# EAGLE design routev3.2 (EAGLE 8.6.0)

## Sheet 1 of 2
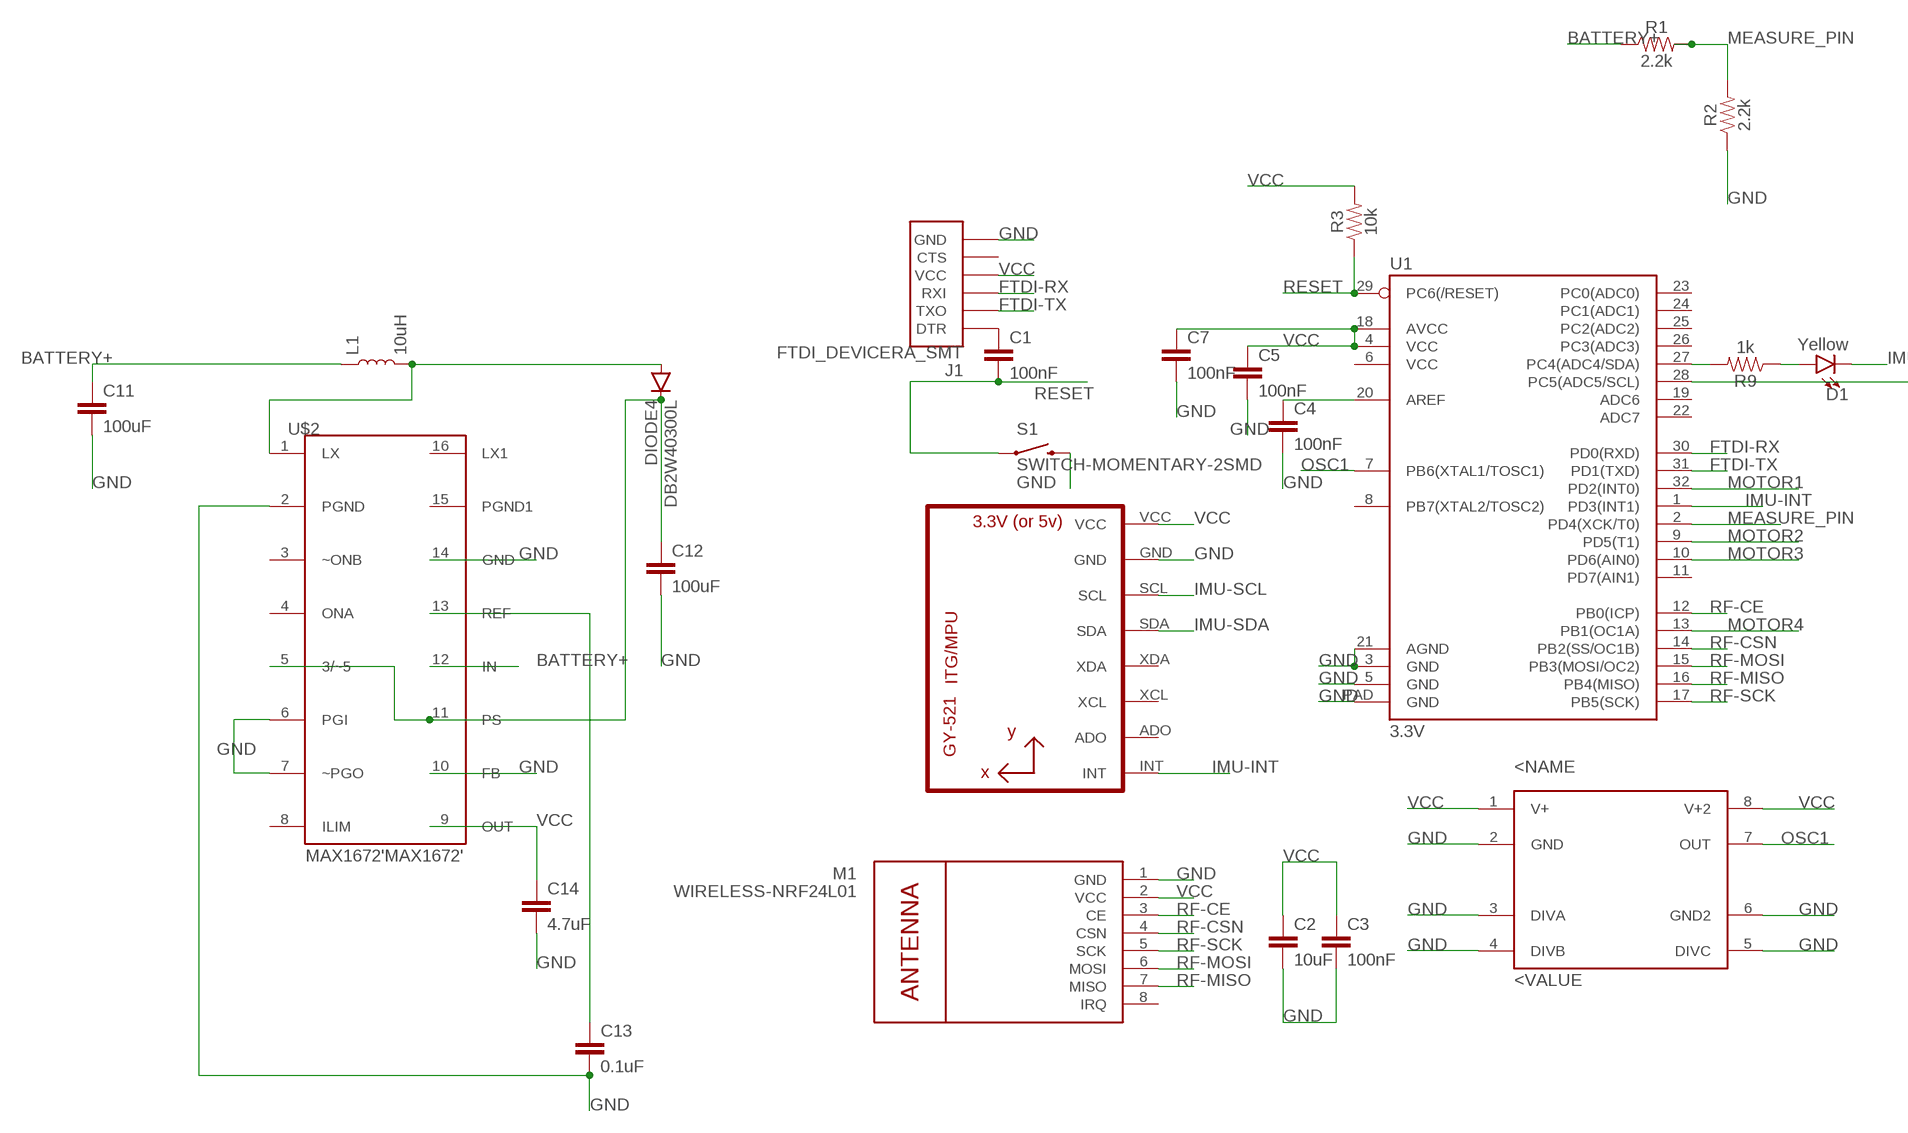
[diagram p0: schematic, sheet 1, part 1 of 2]
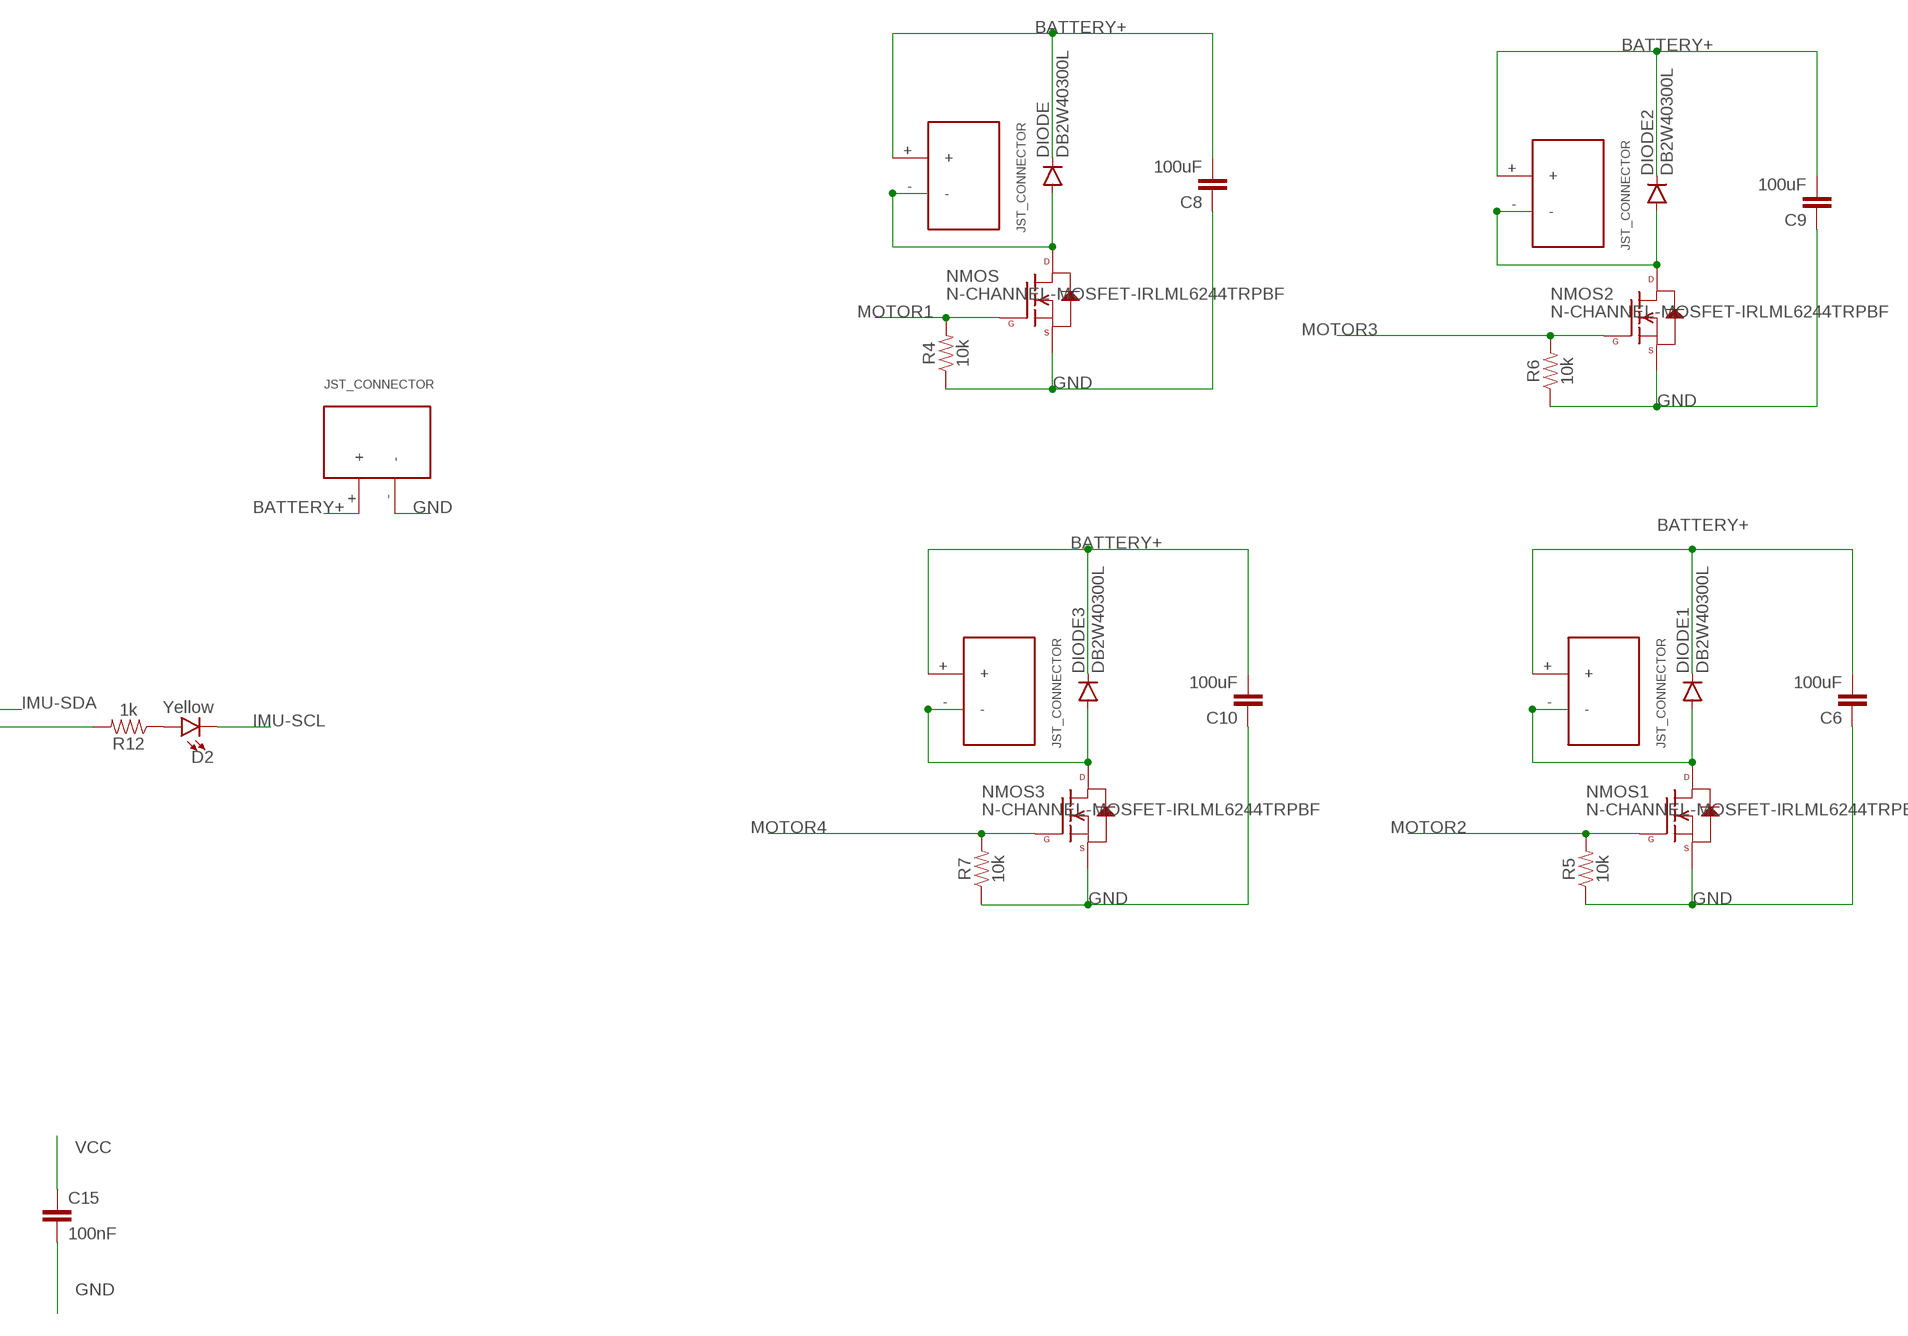
[diagram p1: schematic, sheet 1, part 2 of 2]

### Parts
C1  100nF  0.1UF-25V(+80/-20%)(0603)  [0603-CAP]
C2  10uF  CAP0603-CAP  [0603-CAP]
C3  100nF  CAP0603-CAP  [0603-CAP]
C4  100nF  CAP0603-CAP  [0603-CAP]
C5  100nF  CAP0603-CAP  [0603-CAP]
C6  100uF  CAP0603-CAP  [0603-CAP]
C7  100nF  CAP0603-CAP  [0603-CAP]
C8  100uF  CAP0603-CAP  [0603-CAP]
C9  100uF  CAP0603-CAP  [0603-CAP]
C10  100uF  CAP0603-CAP  [0603-CAP]
C11  100uF  CAP0603-CAP  [0603-CAP]
C12  100uF  CAP0603-CAP  [0603-CAP]
C13  0.1uF  CAP0603-CAP  [0603-CAP]
C14  4.7uF  CAP0603-CAP  [0603-CAP]
C15  100nF  0.1UF-25V(+80/-20%)(0603)  [0603-CAP]
D1  Yellow  LED-YELLOWLILYPAD  [LED-1206]
D2  Yellow  LED-YELLOWLILYPAD  [LED-1206]
DIODE  DB2W40300L  [MINI2-F3-B]
DIODE1  DB2W40300L  [MINI2-F3-B]
DIODE2  DB2W40300L  [MINI2-F3-B]
DIODE3  DB2W40300L  [MINI2-F3-B]
DIODE4  DB2W40300L  [MINI2-F3-B]
J1  FTDI_DEVICERA_SMT  [FTDI_DEVICE_RA_SMT]
L1  10uH  INDUCTOR-0603-33NH  [0603]
M1  WIRELESS-NRF24L01  [WIRELESS-NRF24L01]
MOTOR  JST_CONNECTOR_FEMALE  [JST_CONNECTOR_FEMALE]
MOTOR1  JST_CONNECTOR_FEMALE  [JST_CONNECTOR_FEMALE]
MOTOR2  JST_CONNECTOR_FEMALE  [JST_CONNECTOR_FEMALE]
MOTOR3  JST_CONNECTOR_FEMALE  [JST_CONNECTOR_FEMALE]
NMOS  N-CHANNEL-MOSFET-IRLML6244TRPBF  [SOT23-3]
NMOS1  N-CHANNEL-MOSFET-IRLML6244TRPBF  [SOT23-3]
NMOS2  N-CHANNEL-MOSFET-IRLML6244TRPBF  [SOT23-3]
NMOS3  N-CHANNEL-MOSFET-IRLML6244TRPBF  [SOT23-3]
R1  2.2k  2.2KOHM-0603-1/10W-1%  [0603]
R2  2.2k  2.2KOHM-0603-1/10W-1%  [0603]
R3  10k  2.2KOHM-0603-1/10W-1%  [0603]
R4  10k  2.2KOHM-0603-1/10W-1%  [0603]
R5  10k  2.2KOHM-0603-1/10W-1%  [0603]
R6  10k  2.2KOHM-0603-1/10W-1%  [0603]
R7  10k  2.2KOHM-0603-1/10W-1%  [0603]
R9  1k  2.2KOHM-0603-1/10W-1%  [0603]
R12  1k  2.2KOHM-0603-1/10W-1%  [0603]
S1  SWITCH-MOMENTARY-2SMD  [TACTILE-SWITCH-SMD]
U1  3.3V  ATMEGA328P_MLFMLF32  [MLF32-PAD]
U2  GY-521MPU6050  [GY-521]
U$1  JST_CONNECTOR_FEMALE  [JST_CONNECTOR_FEMALE]
U$2  MAX1672'MAX1672'  [21-0055H_16]
U$3  LTC6930CMS8-8.19LTC6930CMS8-8.19  [SOP65P490X110-8N]

### Nets
BATTERY+: C6.2 C8.2 C9.2 C10.2 C11.1 DIODE1.NEG(GPIN) DIODE2.NEG(GPIN) DIODE3.NEG(GPIN) DIODE.NEG(GPIN) L1.1 MOTOR1.+ MOTOR2.+ MOTOR3.+ MOTOR.+ R1.1 U$1.+ U$2.12(IN)
FTDI-RX: J1.3(RXI) U1.30(PD0(RXD))
FTDI-TX: J1.2(TXO) U1.31(PD1(TXD))
GND: C2.2 C3.2 C4.2 C5.2 C6.1 C7.2 C8.1 C9.1 C10.1 C11.2 C12.2 C13.2 C14.2 C15.2 J1.6(GND) M1.1(GND) NMOS1.2(S) NMOS2.2(S) NMOS3.2(S) NMOS.2(S) R2.1 R4.1 R5.1 R6.1 R7.1 S1.3 U1.3(GND) U1.5(GND) U1.21(AGND) U1.PAD(GND) U2.GND U$1.- U$2.2(PGND) U$2.6(PGI) U$2.7(~PGO) U$2.10(FB) U$2.14(GND) U$3.2(GND) U$3.3(DIVA) U$3.4(DIVB) U$3.5(DIVC) U$3.6(GND2)
IMU-INT: U1.1(PD3(INT1)) U2.INT
IMU-SCL: D2.C U2.SCL
IMU-SDA: D1.C U2.SDA
MEASURE_PIN: R1.2 R2.2 U1.2(PD4(XCK/T0))
MOTOR1: NMOS.1(G) R4.2 U1.32(PD2(INT0))
MOTOR2: NMOS1.1(G) R5.2 U1.9(PD5(T1))
MOTOR3: NMOS2.1(G) R6.2 U1.10(PD6(AIN0))
MOTOR4: NMOS3.1(G) R7.2 U1.13(PB1(OC1A))
N$1: DIODE4.POS(PPIN) L1.2 U$2.1(LX)
N$2: C4.1 U1.20(AREF)
N$3: R9.2 U1.27(PC4(ADC4/SDA))
N$4: DIODE1.POS(PPIN) MOTOR1.- NMOS1.3(D)
N$5: DIODE2.POS(PPIN) MOTOR2.- NMOS2.3(D)
N$6: DIODE.POS(PPIN) MOTOR.- NMOS.3(D)
N$7: DIODE3.POS(PPIN) MOTOR3.- NMOS3.3(D)
N$8: D1.A R9.1
N$9: D2.A R12.1
N$10: R12.2 U1.28(PC5(ADC5/SCL))
N$13: C1.1 J1.1(DTR)
OSC1: U1.7(PB6(XTAL1/TOSC1)) U$3.7(OUT)
RESET: C1.2 R3.1 S1.1 U1.29(PC6(/RESET))
RF-CE: M1.3(CE) U1.12(PB0(ICP))
RF-CSN: M1.4(CSN) U1.14(PB2(SS/OC1B))
RF-MISO: M1.7(MISO) U1.16(PB4(MISO))
RF-MOSI: M1.6(MOSI) U1.15(PB3(MOSI/OC2))
RF-SCK: M1.5(SCK) U1.17(PB5(SCK))
VCC: C2.1 C3.1 C5.1 C7.1 C14.1 C15.1 J1.4(VCC) M1.2(VCC) R3.2 U1.4(VCC) U1.18(AVCC) U2.VCC U$2.9(OUT) U$3.1(V+) U$3.8(V+2)
VR-PS: C12.1 DIODE4.NEG(GPIN) U$2.5(3/~5) U$2.11(PS)
VR-REF: C13.1 U$2.13(REF)
Unconnected: J1.5(CTS) M1.8(IRQ) U1.6(VCC) U1.8(PB7(XTAL2/TOSC2)) U1.11(PD7(AIN1)) U1.19(ADC6) U1.22(ADC7) U1.23(PC0(ADC0)) U1.24(PC1(ADC1)) U1.25(PC2(ADC2)) U1.26(PC3(ADC3)) U2.ADO U2.XCL U2.XDA U$2.3(~ONB) U$2.4(ONA) U$2.8(ILIM) U$2.15(PGND1) U$2.16(LX1)

## Sheet 2 of 2

## Library data of the parts
C1 C15 = SparkFun-Capacitors:0.1UF-25V(+80/-20%)(0603): CAP-00810 Ceramic Standard decoupling cap; PROD_ID: CAP-00810; VALUE: 0.1uF
C2-C14 = SparkFun-Passives:CAP: Capacitor Standard 0603 ceramic capacitor, and 0.1" leaded capacitor.
D1 D2 = SparkFun-LED:LED-YELLOW: Yellow SMD LED Used in manufacturing several products at SparkFun. Packages: 0603 - SMD 0603 package[Product Link] <http://www.kingbrightusa.com/product.asp?catalog_name=LED&product_id=APT1608SYCK> 0603 -SMART - SMART SMD 0603 package (more efficient/more expensive) [Product Link] <http://www.osram-os.com/osram_os/en/products/product-catalog/led-light-emitting-diodes/smartled-0603/ly-l29k/index.jsp> LilyPad - SMD1206 package[Product Datasheet] <https://www.sparkfun.com/datasheets/DevTools/LilyPad/Q150YUS4.pdf> SparkFun Products: Blynk Board <https://www.sparkfun.com/products/13794> IOIO-OTG <https://www.sparkfun.com/products/13613> XBee Explorer Serial <https://www.sparkfun.com/products/13225>; PROD_ID: DIO-09909
DIODE DIODE1-DIODE4 = quad:DB2W40300L
J1 = quad:FTDI_DEVICE: Connector which mates to FTDI basic or FTDI cable.; PROD_ID: CONN-08971
L1 = SparkFun-Coils:INDUCTOR: Inductors Resist changes in electrical current. Basically a coil of wire. SparkFun Products: SparkFun Load Cell Amplifier - HX711 <https://www.sparkfun.com/products/13879> IOIO-OTG - V2.2 <https://www.sparkfun.com/products/13613>; PROD_ID: NDUC-07874; VALUE: 33nH/±5%/500mA
M1 = quad:WIRELESS-NRF24L01: 2.4 GHz Wireless Module based on NRF24L01 chip
MOTOR MOTOR1-MOTOR3 U$1 = quad:JST_CONNECTOR_FEMALE
NMOS NMOS1-NMOS3 = quad:N-CHANNEL-MOSFET: N-Channel MOSFET Mode Field Effect Transistor; DATASHEET: http://www.mouser.com/ds/2/196/irlml6244pbf-936666.pdf; MOUSER: 942-IRLML6244TRPBF; URL: http://www.mouser.com/Search/ProductDetail.aspx?R=IRLML6244TRPBFvirtualkey57370000virtualkey942-IRLML6244TRPBF
R1 R2 = SparkFun-Resistors:2.2KOHM: 2.2kΩ resistor A resistor is a passive two-terminal electrical component that implements electrical resistance as a circuit element. Resistors act to reduce current flow, and, at the same time, act to lower voltage levels within circuits. - Wikipedia; PROD_ID: RES-08272
R3-R7 R9 R12 = SparkFun-Resistors:2.2KOHM: 2.2kΩ resistor A resistor is a passive two-terminal electrical component that implements electrical resistance as a circuit element. Resistors act to reduce current flow, and, at the same time, act to lower voltage levels within circuits. - Wikipedia; PROD_ID: RES-08272; VALUE: 2.2k
S1 = quad:SWITCH-MOMENTARY-2: Various NO switches- pushbuttons, reed, etc; PROD_ID: SWCH-08247
U1 = SparkFun-DigitalIC:ATMEGA328P_MLF: 32-Pin Atmega328 part Commonly used on Arduino compatible boards Available in QFP and QFN packages TQFP is IC-09069 QFN is non-stock
U2 = quad:GY-521
U$2 = voltreg:MAX1672
U$3 = LTC6390:LTC6930CMS8-8.19

## Net classes
0 default: width 0.305 mm

## Board
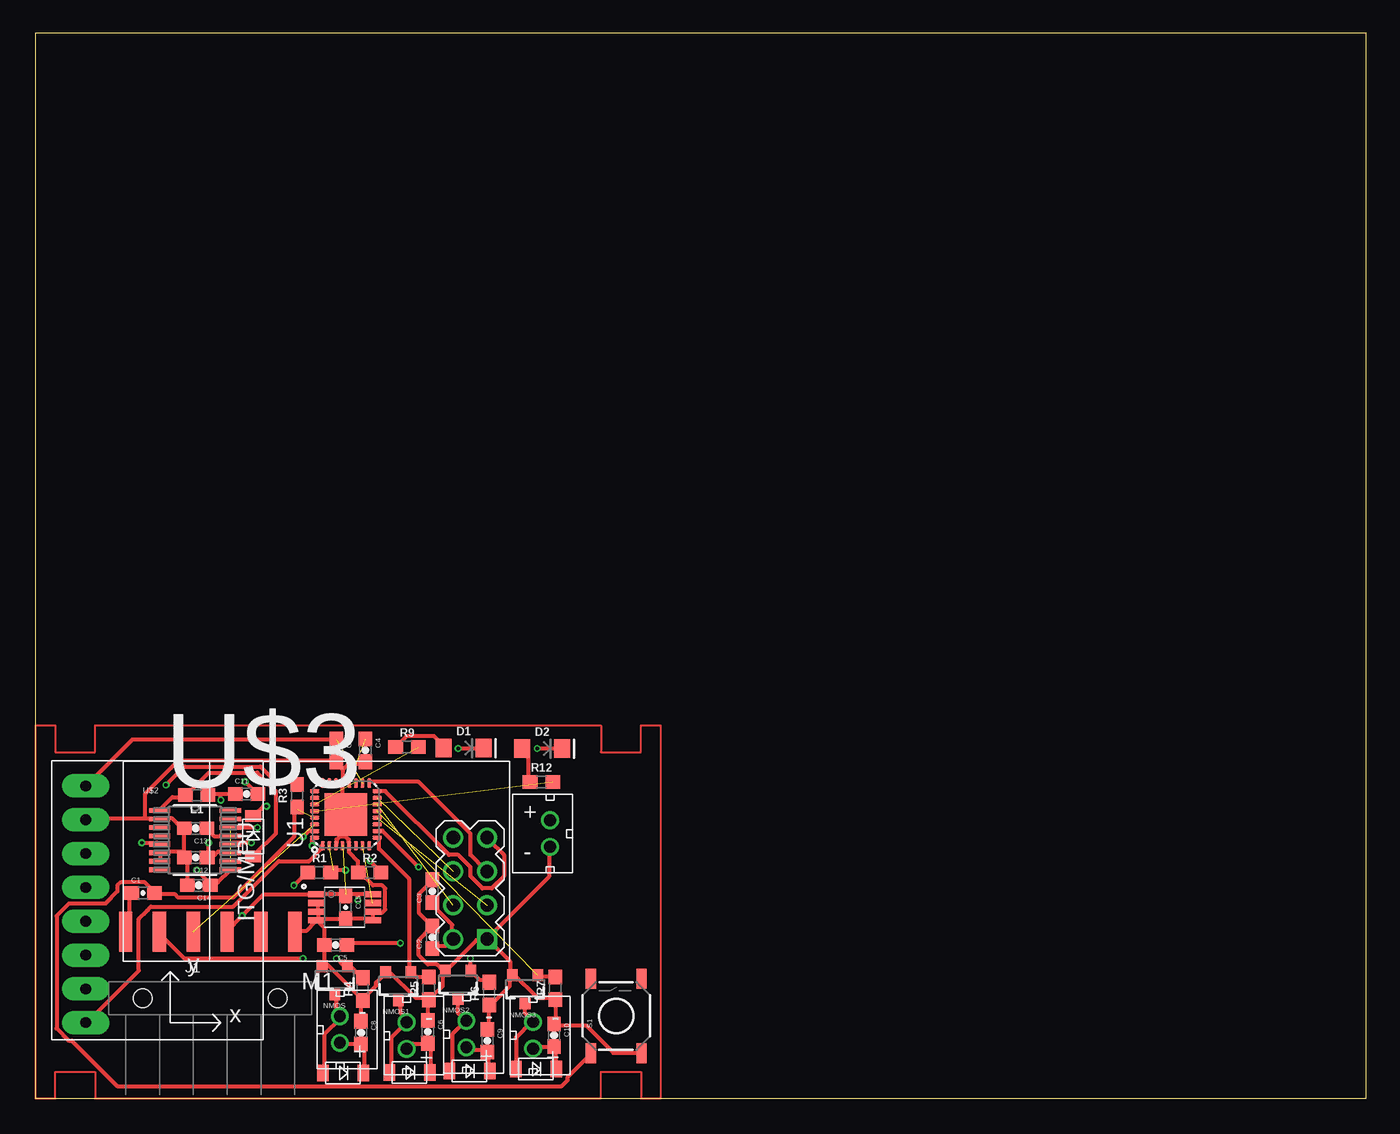
[diagram p2: board, top side]
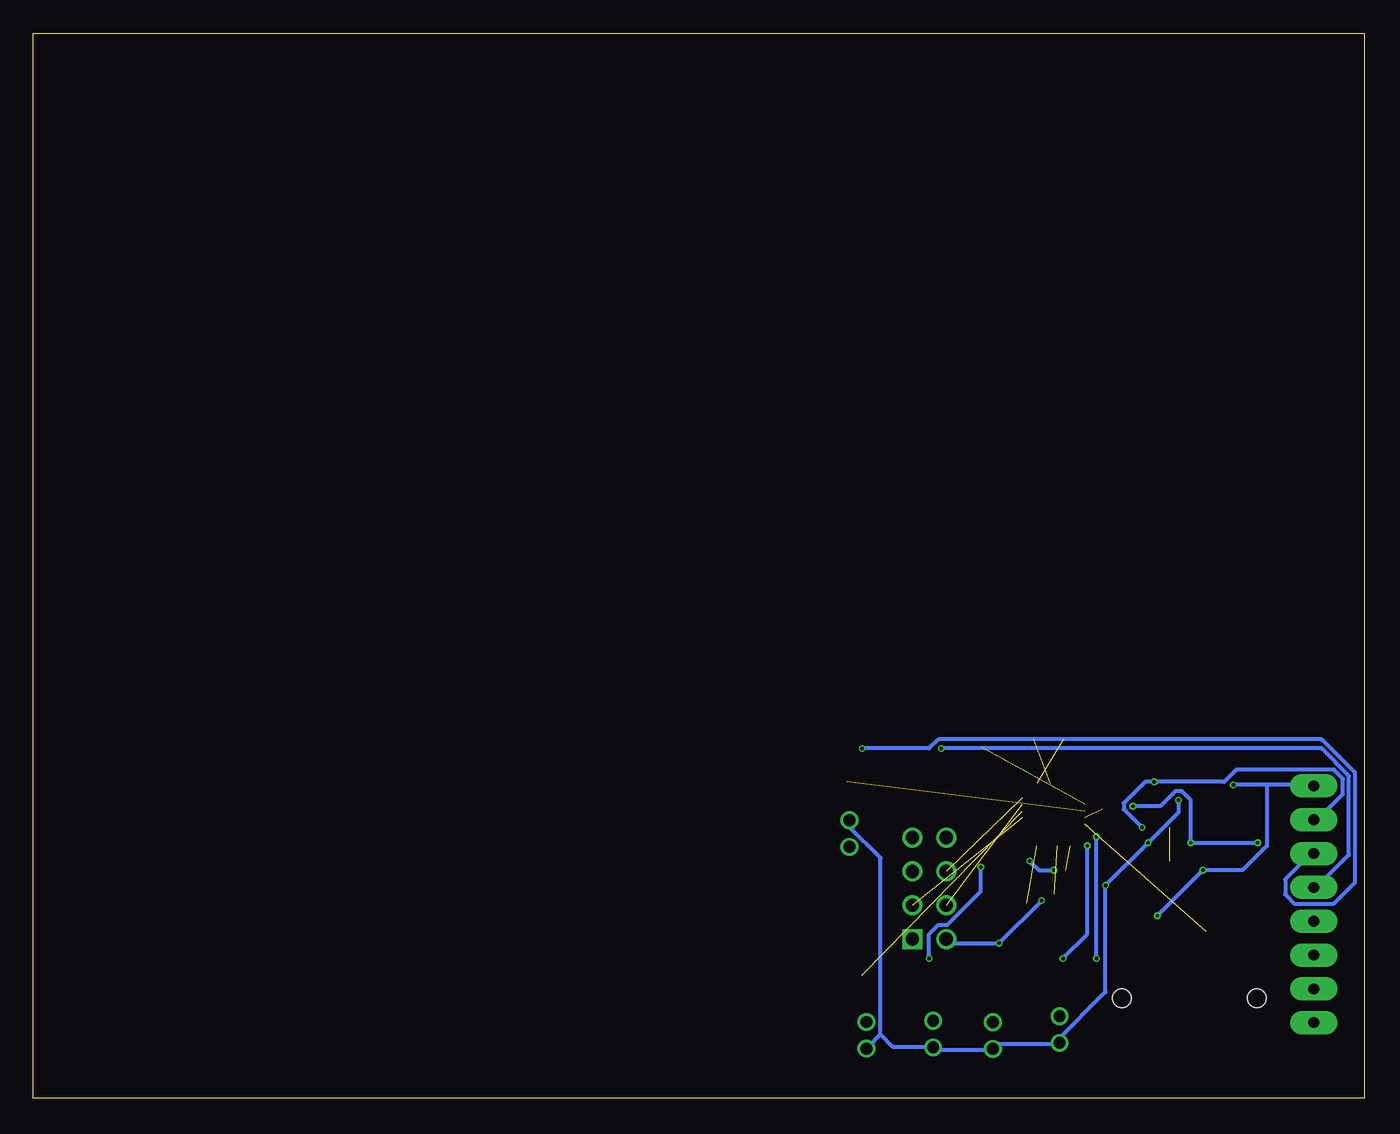
[diagram p3: board, bottom side, seen from below]

Size 100 x 80 mm. Coordinates in mm from the lower left corner, seen from the top.
Outline: 0,0 100,0 100,80 0,80 0,0
Copper layers (1*16): Top 0.035559375mm / dielectric 1.6mm / Bottom 0.035559375mm
Design rules "oshpark-2layer": minimum track width 6mil, minimum drill 10mil, track to track 6mil, track to pad 6mil, pad to pad 6mil, via to via 6mil, smd to smd 6mil, copper to edge 15mil, drill to drill 6mil, minimum pad ring 5mil, minimum via ring 5mil, stop-mask expansion 2.5mil, vias tented up to drill 0mil, thermal gap 10mil

### Footprints (pad centres in the part's own frame; a part is rotated, then mirrored left to right if it is on the bottom)
0603-CAP = smd 1.1 x 1: 1 -0.85,0; 2 0.85,0
LED-1206 = smd 1.2 x 1.4: A -1.5,0; C 1.5,0
MINI2-F3-B = smd 1.22 x 0.85: NEG 0,1.55; POS 0,-1.5
FTDI_DEVICE_RA_SMT = smd 1 x 3: 1 -6.35,5; 2 -3.81,5; 3 -1.27,5; 4 1.27,5; 5 3.81,5; 6 6.35,5 | hole 1.4: -5.08,0; 5.08,0
0603 = smd 1.1 x 1: 1 -0.85,0; 2 0.85,0
WIRELESS-NRF24L01 = drill 1 square: 1 -12.7,6.35 | drill 1: 2 -10.16,6.35; 3 -12.7,3.81; 4 -10.16,3.81; 5 -12.7,1.27; 6 -10.16,1.27; 7 -12.7,-1.27; 8 -10.16,-1.27
JST_CONNECTOR_FEMALE = drill 0.889: + 0,1; - 0,-1
SOT23-3 = smd 0.8 x 0.9: 1 -0.95,-1; 2 0.95,-1; 3 0,1.1
TACTILE-SWITCH-SMD = smd 1.524 x 0.762: 1 -2.794,1.905; 2 2.794,1.905; 3 -2.794,-1.905; 4 2.794,-1.905
MLF32-PAD = smd 0.7 x 0.3: 1 -2.35,1.75; 2 -2.35,1.25; 3 -2.35,0.75; 4 -2.35,0.25; 5 -2.35,-0.25; 6 -2.35,-0.75; 7 -2.35,-1.25; 8 -2.35,-1.75; 17 2.35,-1.75; 18 2.35,-1.25; 19 2.35,-0.75; 20 2.35,-0.25; 21 2.35,0.25; 22 2.35,0.75; 23 2.35,1.25; 24 2.35,1.75 | smd 0.3 x 0.7: 9 -1.75,-2.35; 10 -1.25,-2.35; 11 -0.75,-2.35; 12 -0.25,-2.35; 13 0.25,-2.35; 14 0.75,-2.35; 15 1.25,-2.35; 16 1.75,-2.35; 25 1.75,2.35; 26 1.25,2.35; 27 0.75,2.35; 28 0.25,2.35; 29 -0.25,2.35; 30 -0.75,2.35; 31 -1.25,2.35; 32 -1.75,2.35 | smd 3.2 x 3.2: PAD 0,0
GY-521 = drill 0.8 pad 1.778 long: ADO -8.89,-6.35; GND -8.89,6.35; INT -8.89,-8.89; SCL -8.89,3.81; SDA -8.89,1.27; VCC -8.89,8.89; XCL -8.89,-3.81; XDA -8.89,-1.27
21-0055H_16 = smd 1.6 x 0.356: 1 -2.654,2.223; 2 -2.654,1.587; 3 -2.654,0.953; 4 -2.654,0.318; 5 -2.654,-0.318; 6 -2.654,-0.953; 7 -2.654,-1.587; 8 -2.654,-2.223; 9 2.654,-2.223; 10 2.654,-1.587; 11 2.654,-0.953; 12 2.654,-0.318; 13 2.654,0.318; 14 2.654,0.953; 15 2.654,1.587; 16 2.654,2.223
SOP65P490X110-8N = smd 1.25 x 0.46: 1 -2.11,0.975; 2 -2.11,0.325; 3 -2.11,-0.325; 4 -2.11,-0.975; 5 2.11,-0.975; 6 2.11,-0.325; 7 2.11,0.325; 8 2.11,0.975

### Placement (x,y rotation side)
C1  8.09,15.42 0 top
C2  29.83,12.11 90 top
C3  29.83,15.57 90 top
C4  24.8,26.14 270 top
C5  22.57,11.52 180 top
C6  29.5,4.99 270 top
C7  22.61,26.14 270 top
C8  24.47,4.94 270 top
C9  33.97,4.33 270 top
C10  38.97,4.74 270 top
C11  15.87,22.86 0 top
C12  12.06,18.09 180 top
C13  12.05,20.29 180 top
C14  12.29,16.01 180 top
C15  23.31,14.35 270 top
D1  32.18,26.31 0 top
D2  38.07,26.27 0 top
DIODE  23.11,1.9 270 top
DIODE1  28.11,1.95 270 top
DIODE2  32.61,2.06 270 top
DIODE3  37.61,2.2 270 top
DIODE4  16.37,19.67 0 top
J1  13.14,7.53 0 top
L1  12.13,22.78 180 top
M1  21.24,18.32 180 top
MOTOR  22.89,5.17 180 top
MOTOR1  27.89,4.72 180 top
MOTOR2  32.39,4.83 180 top
MOTOR3  37.39,4.74 180 top
NMOS  22.5,8.94 180 top
NMOS1  27.27,8.49 180 top
NMOS2  31.77,8.6 180 top
NMOS3  36.8,8.24 180 top
R1  21.34,16.97 0 top
R2  25.12,16.97 0 top
R3  19.68,22.73 90 top
R4  24.61,8.21 90 top
R5  29.58,8.26 90 top
R6  34.11,7.87 90 top
R7  39.08,8.28 90 top
R9  27.92,26.39 0 top
R12  38.02,23.77 0 top
S1  43.64,6.19 90 top
U1  23.34,21.33 90 top
U2  12.67,14.58 0 top
U$1  38.67,19.89 0 top
U$2  11.99,19.4 0 top
U$3  23.23,14.35 0 top

### Tracks (layer width: path | path; a pad name or v marks a point on that pad's centre or on a via)
BATTERY+  (via drill 0.25)
  Top 0.305: C11.1 13.95,22.86 | 13.95,22.86 13.03,22.86 L1.1 | MOTOR.+ 23.09,4.12 24.46,4.12 C8.2 24.69,3.89 24.69,2.06 DIODE.NEG | v19.43,16 20.34,16.92 R1.1 | v16.23,19.2 14.86,19.2 U$2.12 | v13.95,22.4 13.95,22.86 | MOTOR1.+ 28.12,3.89 28.35,4.12 29.49,4.12 C6.2 29.72,4.12 29.72,2.06 DIODE1.NEG | DIODE2.NEG 34.06,2.29 34.06,3.43 C9.2 33.83,3.66 32.46,3.66 MOTOR2.+ | MOTOR3.+ 37.49,3.89 38.86,3.89 C10.2 39.09,3.89 39.09,2.29 DIODE3.NEG
  Bottom 0.305: v13.95,22.4 13.95,21.49 v16.23,19.2 v19.43,16 19.43,8 23.09,4.34 MOTOR.+ 23.09,4.12 27.66,4.12 27.89,3.89 MOTOR1.+ 28.12,3.66 32.23,3.66 MOTOR2.+ 32.46,3.89 35.43,3.89 36.35,4.8 | 36.35,4.8 36.35,18.06 38.63,20.34 38.63,20.8 U$1.+ | 36.35,4.8 37.26,3.89 MOTOR3.+
FTDI-RX  (1 unrouted)
FTDI-TX  (via drill 0.25)
  Top 0.305: v20.12,19.66 20.57,20.12 20.8,20.12 U1.31 | v20.12,10.52 11.2,10.52 9.37,12.34 J1.2
  Bottom 0.305: v20.12,10.52 v20.12,19.66
GND  (via drill 0.25)  (1 unrouted)
  Top 0.305: S1.3 45.49,3.43 43.43,3.43 41.38,5.49 39.09,5.49 C10.1 39.09,5.71 39.09,7.32 R7.1 38.86,7.54 37.72,7.54 35.89,9.37 NMOS3.2 | NMOS3.2 35.66,9.14 35.66,8.46 34.29,7.09 R6.1 34.06,6.86 34.06,5.26 C9.1 | U$1.- 38.63,18.75 38.63,16.69 34.06,12.12 M1.1 | NMOS3.2 35.66,9.37 35.66,10.29 34.06,11.89 M1.1 | U$2.7 9.37,17.83 9.37,18.29 U$2.6 9.37,18.52 11.2,18.52 | C14.2 11.43,16.23 11.43,18.06 C12.2 | 11.2,18.52 11.2,18.29 C12.2 | 11.2,18.52 11.2,20.12 C13.2 10.97,20.34 10.29,21.03 9.37,21.03 U$2.2 9.14,21.03 8.23,21.03 | 11.2,18.52 C12.2 | v15.77,23.77 16.69,22.86 C11.2 | v16.69,20.34 14.86,20.34 U$2.14 | 8.23,21.03 3.89,21.03 U2.GND | C3.2 29.72,16.23 28.8,15.32 28.8,13.95 29.72,13.03 C2.2 29.72,12.8 28.8,11.89 28.8,10.74 29.49,10.06 30.18,10.06 30.63,9.6 NMOS2.2 | NMOS2.2 30.63,9.37 30.63,8.46 29.72,7.54 R5.1 | C6.1 29.49,5.94 29.49,7.32 R5.1 | 23.09,24.69 23.09,23.77 U1.21 23.09,23.55 23.09,21.72 23.32,21.49 U1.PAD 23.32,21.26 23.32,19.66 | 23.09,24.69 22.63,25.15 C7.2 22.4,25.38 10.74,25.38 8.23,22.86 8.23,21.03 | 23.09,24.69 23.55,25.15 24.69,25.15 C4.2 | 23.32,19.66 22.86,19.66 22.63,19.43 22.63,19.2 U1.3 | 23.32,19.66 23.55,19.43 23.55,19.2 U1.5 23.55,18.97 23.55,18.52 24.23,17.83 24.23,17.14 R2.1 24.46,16.92 25.38,16 26.06,16 26.29,15.77 26.29,14.17 26.06,13.95 25.38,13.95 | R4.1 24.69,7.54 25.6,8.46 25.6,8.69 26.29,9.37 NMOS1.2 26.52,9.6 28.57,7.54 29.49,7.54 R5.1 | C8.1 24.46,5.94 24.46,7.32 R4.1 | 25.38,13.95 25.38,13.49 U$3.5 25.15,13.49 23.32,13.49 C15.2 23.09,13.49 21.26,13.49 | 21.72,10.29 21.72,11.43 C5.2 21.72,11.66 21.72,12.8 21.26,13.26 U$3.4
  Top 0.305: 21.72,10.29 21.72,10.06 NMOS.2 21.72,10.29 | 21.26,13.49 21.26,13.95 U$3.3 21.26,14.17 21.26,14.63 U$3.2 | 21.26,13.49 U$3.4 | 21.72,10.29 24.46,7.54 R4.1 | J1.6 19.66,12.57 20.34,12.57 21.03,13.26 U$3.4 | 25.38,13.95 U$3.6 | M1.1 33.83,11.89 33.15,11.89 30.86,9.6 NMOS2.2
  Bottom 0.305: U2.GND 3.66,20.8 1.6,22.86 1.6,24 2.29,24.69 9.6,24.69 10.52,23.77 v15.77,23.77 16.46,23.77 18.06,22.17 18.06,21.72 v16.69,20.34
IMU-INT
  Top 0.305: U1.1 21.49,18.97 21.49,18.75 20.57,17.83 18.29,17.83 14.86,14.4 8.69,14.4 8.39,14.11 7.77,13.49 7.77,9.6 3.89,5.71 U2.INT
IMU-SCL  (via drill 0.25)
  Top 0.305: v37.72,26.29 39.55,26.29 D2.C
  Bottom 0.305: v37.72,26.29 32.69,26.29 32,26.98 3.2,26.98 0.69,24.46 0.69,16.23 2.29,14.63 5.26,14.63 5.94,15.32 5.94,16.46 3.89,18.52 U2.SCL
IMU-SDA  (via drill 0.25)
  Top 0.305: v31.77,26.29 33.6,26.29 D1.C
  Bottom 0.305: v31.77,26.29 3.2,26.29 1.14,24.23 1.14,18.29 3.66,15.77 U2.SDA
MEASURE_PIN  (via drill 0.25)  (1 unrouted)
  Top 0.305: v23.32,17.14 22.4,17.14 R1.2 | v25.15,17.83 25.83,17.14 R2.2
  Bottom 0.305: v23.32,17.14 24.46,17.14 v25.15,17.83
MOTOR1  (via drill 0.25)
  Top 0.305: v20.8,18.97 20.8,19.43 U1.32 | v22.63,10.52 23.32,9.83 NMOS.1 23.55,10.06 24.46,9.14 R4.2
  Bottom 0.305: v20.8,18.97 20.8,12.34 v22.63,10.52
MOTOR2
  Top 0.305: U1.9 25.83,19.43 25.83,18.75 28.12,16.46 28.12,9.6 NMOS1.1 28.35,9.37 28.57,9.14 29.49,9.14 R5.2
MOTOR3  (via drill 0.25)
  Top 0.305: v28.8,17.37 26.06,20.12 25.83,20.12 U1.10 | v32.69,10.52 32.69,9.6 NMOS2.1 32.92,9.37 33.38,8.91 34.06,8.91 R6.2
  Bottom 0.305: v28.8,17.37 28.8,15.54 31.32,13.03 32,13.03 32.69,12.34 v32.69,10.52
MOTOR4  (1 unrouted)
  Top 0.305: NMOS3.1 37.95,9.14 38.86,9.14 R7.2
N$1
  Top 0.305: U$2.1 9.37,21.72 10.29,22.63 11.2,22.63 L1.2 11.43,22.86 13.03,24.46 16.69,24.46 18.06,23.09 18.06,19.89 16.46,18.29 DIODE4.POS
N$2  (1 unrouted)
N$3  (1 unrouted)
N$4
  Top 0.305: NMOS1.3 27.43,7.32 27.43,6.4 27.89,5.94 MOTOR1.- 26.75,4.57 26.75,2.06 DIODE1.POS
N$5
  Top 0.305: NMOS2.3 31.77,7.32 31.77,6.4 32.23,5.94 MOTOR2.- 32.23,5.71 31.32,4.8 31.32,2.29 DIODE2.POS
N$6
  Top 0.305: NMOS.3 22.63,7.77 22.63,6.4 22.86,6.17 MOTOR.- 22.86,5.94 21.72,4.8 21.72,2.06 DIODE.POS
N$7
  Top 0.305: NMOS3.3 36.8,7.09 36.8,6.4 37.26,5.94 MOTOR3.- 37.26,5.71 36.12,4.57 36.12,2.29 DIODE3.POS
N$8
  Top 0.305: R9.1 27.2,26.52 27.89,27.2 29.95,27.2 30.63,26.52 D1.A
N$9
  Top 0.305: R12.1 37.03,23.77 37.03,25.6 36.58,26.06 D2.A
N$10  (1 unrouted)
N$11
  Top 0.152: 0,0 1.5,0 1.5,2 4.5,2 4.5,0 42.5,0 42.5,2 45.5,2 45.5,0 47,0 47,28 45.5,28 45.5,26 42.5,26 42.5,28 4.5,28 4.5,26 1.5,26 1.5,28 0,28 0,0
N$13
  Top 0.305: C1.1 7.09,15.32 7.09,12.8 6.86,12.57 J1.1
OSC1  (1 unrouted)
RESET  (1 unrouted)
  Top 0.305: R3.1 19.66,21.72 19.43,21.49 19.43,19.66 14.86,15.09 10.74,15.09 10.52,15.32 9.14,15.32 C1.2 8.91,15.54 8.23,16.23 6.4,16.23 6.17,16 6.17,15.54 5.26,14.63 2.52,14.63 1.6,13.72 1.6,5.26 2.52,4.34 2.74,4.34 6.17,0.91 39.55,0.91 40.01,1.37 40.01,1.6 41.6,3.2 S1.1
RF-CE  (1 unrouted)
RF-CSN  (1 unrouted)
RF-MISO
  Top 0.305: U1.16 25.83,23.09 26.29,23.09 31.09,18.29 31.77,18.29 32.69,17.37 32.69,16.69 33.6,15.77 34.29,15.77 35.2,16.69 35.2,18.29 34.06,19.43 M1.7
RF-MOSI  (1 unrouted)
RF-SCK
  Top 0.305: U1.17 25.15,23.77 28.8,23.77 32.69,19.89 32.69,18.29 33.83,17.14 M1.5
VCC  (via drill 0.25)  (2 unrouted)
  Top 0.305: v27.43,11.66 23.55,11.66 C5.1 | C2.1 29.95,11.43 30.86,11.43 31.32,11.89 M1.2 31.32,12.12 31.32,13.03 29.95,14.4 29.95,14.63 C3.1 | 24.23,15.32 25.15,15.32 U$3.8 | 24.23,15.32 23.32,15.32 C15.1 23.09,15.32 21.26,15.32 U$3.1 21.03,15.32 17.14,15.32 v15.54,13.72 14.4,12.57 J1.4 | 24.23,15.32 v24.23,14.86 | U$2.9 14.63,17.14 13.72,16.23 13.26,16.23 C14.1 13.03,16.23 v12.12,17.14 | v9.83,23.55 11.2,24.92 16.92,24.92 18.06,23.77 19.66,23.77 R3.2 | C7.1 22.4,26.98 7.32,26.98 3.89,23.55 U2.VCC
  Bottom 0.305: M1.2 31.32,11.89 31.09,11.66 v27.43,11.66 v24.23,14.86 | 7.32,23.55 3.89,23.55 U2.VCC | 7.32,23.55 v9.83,23.55 | 7.32,23.55 7.32,18.97 9.14,17.14 v12.12,17.14 v15.54,13.72
VR-PS  (via drill 0.25)
  Top 0.305: 13.03,18.29 13.49,18.29 13.72,18.52 14.63,18.52 U$2.11 | v17.37,21.95 17.14,21.95 16.46,21.26 DIODE4.NEG | 13.03,18.29 v13.03,19.2 | 13.03,18.29 C12.1 | v8,19.2 9.14,19.2 U$2.5
  Bottom 0.305: v17.37,21.95 15.32,21.95 14.17,23.09 13.72,23.09 13.03,22.4 v13.03,19.2 v8,19.2
VR-REF
  Top 0.305: C13.1 13.03,20.12 13.49,19.66 14.63,19.66 U$2.13